# Altium project LIN_break.PrjPcb
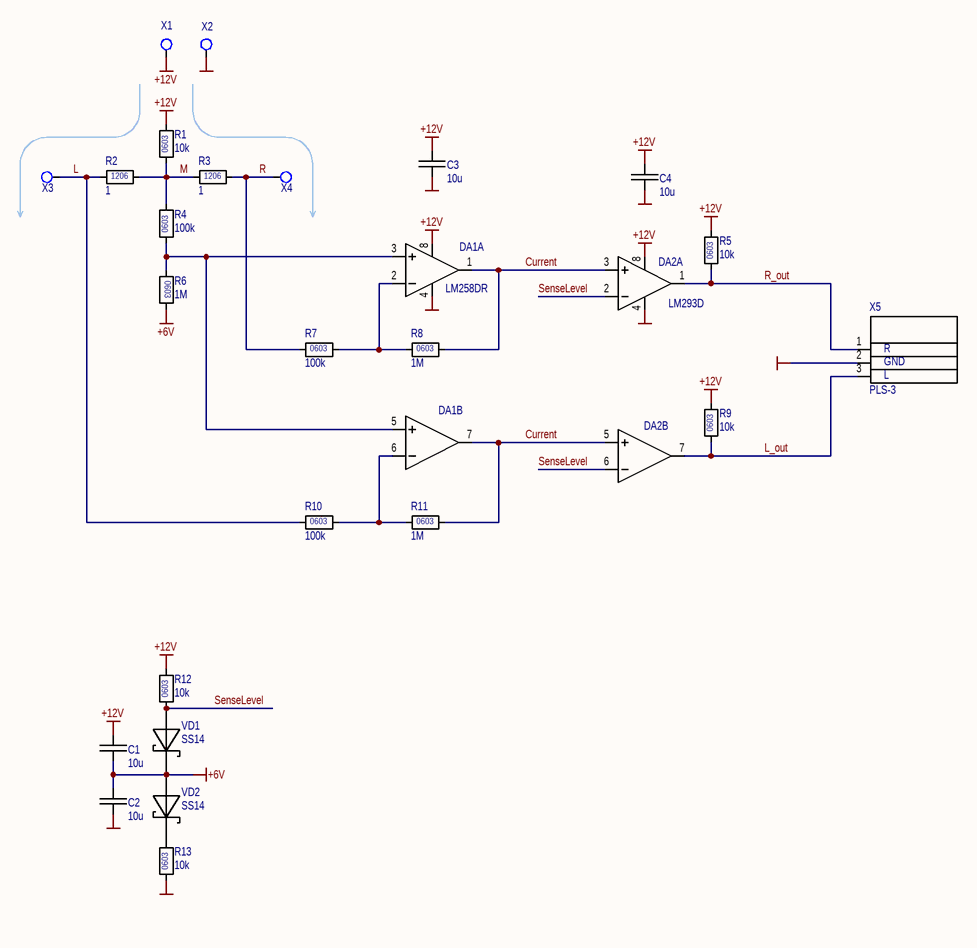
[diagram p0: LIN_break.SchDoc]
Revision: Rev1; Title: LIN Break
1 sheet, 26 parts. Net scope: global (net labels, ports and power ports of the same name join across sheets).
Board file: LIN_break.PcbDoc

## Sheet LIN_break.SchDoc: LIN Break
size A4; Author: ARNik; Revision: Rev1; SheetNumber: 1; SheetTotal: 1

### Parts
C1  10u  [C0603]
C2  10u  [C0603]
C3  10u  [C0603]
C4  10u  [C0603]
DA1  Part Number: LM258DR  [TI-SOIC8 D]  (hidden comment: LM258)  (parts A,B of 2)
DA2  Part Number: LM293D  [TI-SOIC8 D]  (hidden comment: Comparator)  (parts A,B of 2)
R1  10k  [R0603]
R2  1  [R1206]
R3  1  [R1206]
R4  100k  [R0603]
R5  10k  [R0603]
R6  1M  [R0603]
R7  100k  [R0603]
R8  1M  [R0603]
R9  10k  [R0603]
R10  100k  [R0603]
R11  1M  [R0603]
R12  10k  [R0603]
R13  10k  [R0603]
VD1  SS14  [DO-214AC(SMA)]
VD2  SS14  [DO-214AC(SMA)]
X1  1-pin_round NB  [Hole-2.4-5]  (value not drawn)  (no BOM)
X2  1-pin_round NB  [Hole-2.4-5]  (value not drawn)  (no BOM)
X3  1-pin_round NB  [Hole-2.4-5]  (value not drawn)  (no BOM)
X4  1-pin_round NB  [Hole-2.4-5]  (value not drawn)  (no BOM)
X5  PLS-3  [PLS-3]

### Nets
+6V: C1.2 C2.1 R6.2 VD1.1(C) VD2.2(A)
+12V: C1.1 C3.1 C4.1 DA1.8(VCC) DA2.8(VCC) R1.2 R5.2 R9.2 R12.2 X1.1
GND: C2.2 C3.2 C4.2 DA1.4(GND) DA2.4(GND) R13.1 X2.1 X5.2
Current: DA1.1(1OUT) DA1.7(2OUT) DA2.3(1IN+) DA2.5(2IN+) R8.2 R11.2
L: R2.1 R10.1 X3.1
L_out: DA2.7(2OUT) R9.1 X5.3
M: R1.1 R2.2 R3.1 R4.2
R: R3.2 R7.1 X4.1
R_out: DA2.1(1OUT) R5.1 X5.1
SenseLevel: DA2.2(1IN-) DA2.6(2IN-) R12.1 VD1.2(A)
NetDA1_2: DA1.2(1IN-) R7.2 R8.1
NetDA1_3: DA1.3(1IN+) DA1.5(2IN+) R4.1 R6.1
NetDA1_6: DA1.6(2IN-) R10.2 R11.1
NetR13_2: R13.2 VD2.1(C)

### Notes on the sheet
- (near X5) GND
- (near X5) L
- (near X5) R
- Title:
- Size:
- Date:
- A4
- Number:
- Time:
- Revision:
- Sheet
- of
- File:
- Author:
- (in symbol R0603 1M ±1% E24) 0603
- (in symbol R0603 10k ±1% E24) 0603
- (in symbol R1206 1 1%) 1206

### Library data of the parts
C1-C4 = C0603 10u 25V X5R 85°C ±20%: General  ceramic capacitor; Part Number: GRM188R61E106MA73#; Alt Part: C1608X5R106MFT(Darfon) C1608X5R1E106M080AC(TDK); Voltage: 25V; Dielectric: X5R; Tolerance: ±20%; Vendor: Murata; Component Name: C0603 10u 25V X5R 85°C ±20%; HelpURL: https://psearch.en.murata.com/capacitor/result/smd/?pid=GRM188R61E106MA73#; Temperature: 85°C; Pins: 2; Package: C0603; Value: 10u
DA1 = LM258DR: Op Amp; Vendor: TI; Component Name: LM258DR; HelpURL: https://www.chipdip.ru/product/lm258d-ti; Pins: 8; Package: SOIC8; Value: LM258
DA2 = LM293D: Dual Comparator OK; Vendor: TI; Value: LM293; Component Name: LM293D; HelpURL: https://www.ti.com/lit/ds/symlink/lm293.pdf; Pins: 8; Package: TSSOP8; Price: 0.1
R1 R5 R9 R12 R13 = R0603 10k ±1% E24: Thick Film Chip Resistor - CR Series; Part Number: CR-03FL7---10k; Alt Part: RTT031002FTH (Ralec); Vendor: Viking; Tolerance: ±1%; Voltage: 75V; Power: 1/10W; Component Name: R0603 10k ±1% E24; HelpURL: https://www.viking.com.tw/en/search/index.html?f%5Bname_model%5D=CR-03FL7---10k&type=product; Pins: 2; Package: R0603; Price: 0.001; Value: 10k
R2 R3 = R1206 1 1%: 1/4W 200V; Part Number: CR-06FL5---1R0; Vendor: Viking; Component Name: R1206 1 1%; HelpURL: https://www.viking.com.tw/en/category/Thick-Film-Resistor-CR..A-Series/Resistor-CR-A.html; Pins: 2; Package: R1206; Price: 0.0009; Value: 1; Power: 1/4W
R4 R7 R10 = R0603 1M ±1% E24: Thick Film Chip Resistor - CR Series; Part Number: CR-03FL7----1M; Alt Part: RTT031004FTH (Ralec); Vendor: Viking; Tolerance: ±1%; Value: 1M; Voltage: 75V; Power: 1/10W; Component Name: R0603 1M ±1% E24; HelpURL: https://www.viking.com.tw/en/search/index.html?f%5Bname_model%5D=CR-03FL7----1M&type=product; Pins: 2; Package: R0603; Price: 0.001
R6 R8 R11 = R0603 1M ±1% E24: Thick Film Chip Resistor - CR Series; Part Number: CR-03FL7----1M; Alt Part: RTT031004FTH (Ralec); Vendor: Viking; Tolerance: ±1%; Voltage: 75V; Power: 1/10W; Component Name: R0603 1M ±1% E24; HelpURL: https://www.viking.com.tw/en/search/index.html?f%5Bname_model%5D=CR-03FL7----1M&type=product; Pins: 2; Package: R0603; Price: 0.001; Value: 1M
VD1 VD2 = SS14: 40V 1A Schottky diode; Vendor: ON; Component Name: SS14; Part Number: SS14; HelpURL: http://www.onsemi.com/pub/Collateral/SS19-D.pdf; Pins: 2; Package: DO-214AC(SMA); Price: 0.04; Value: SS14
X1-X4 = Hole-2.4-5: M2 x .4 Screw with Lock Washer; Component Name: Hole-2.4-5; Pins: 1; Price: 0; Value: Hole-2.4-5
X5 = PLS-3: Component Name: PLS-3; Part Number: PLS-3; Pins: 3; Value: PLS-3